# EAGLE schematic ESP-XBee (EAGLE 9.2.2)
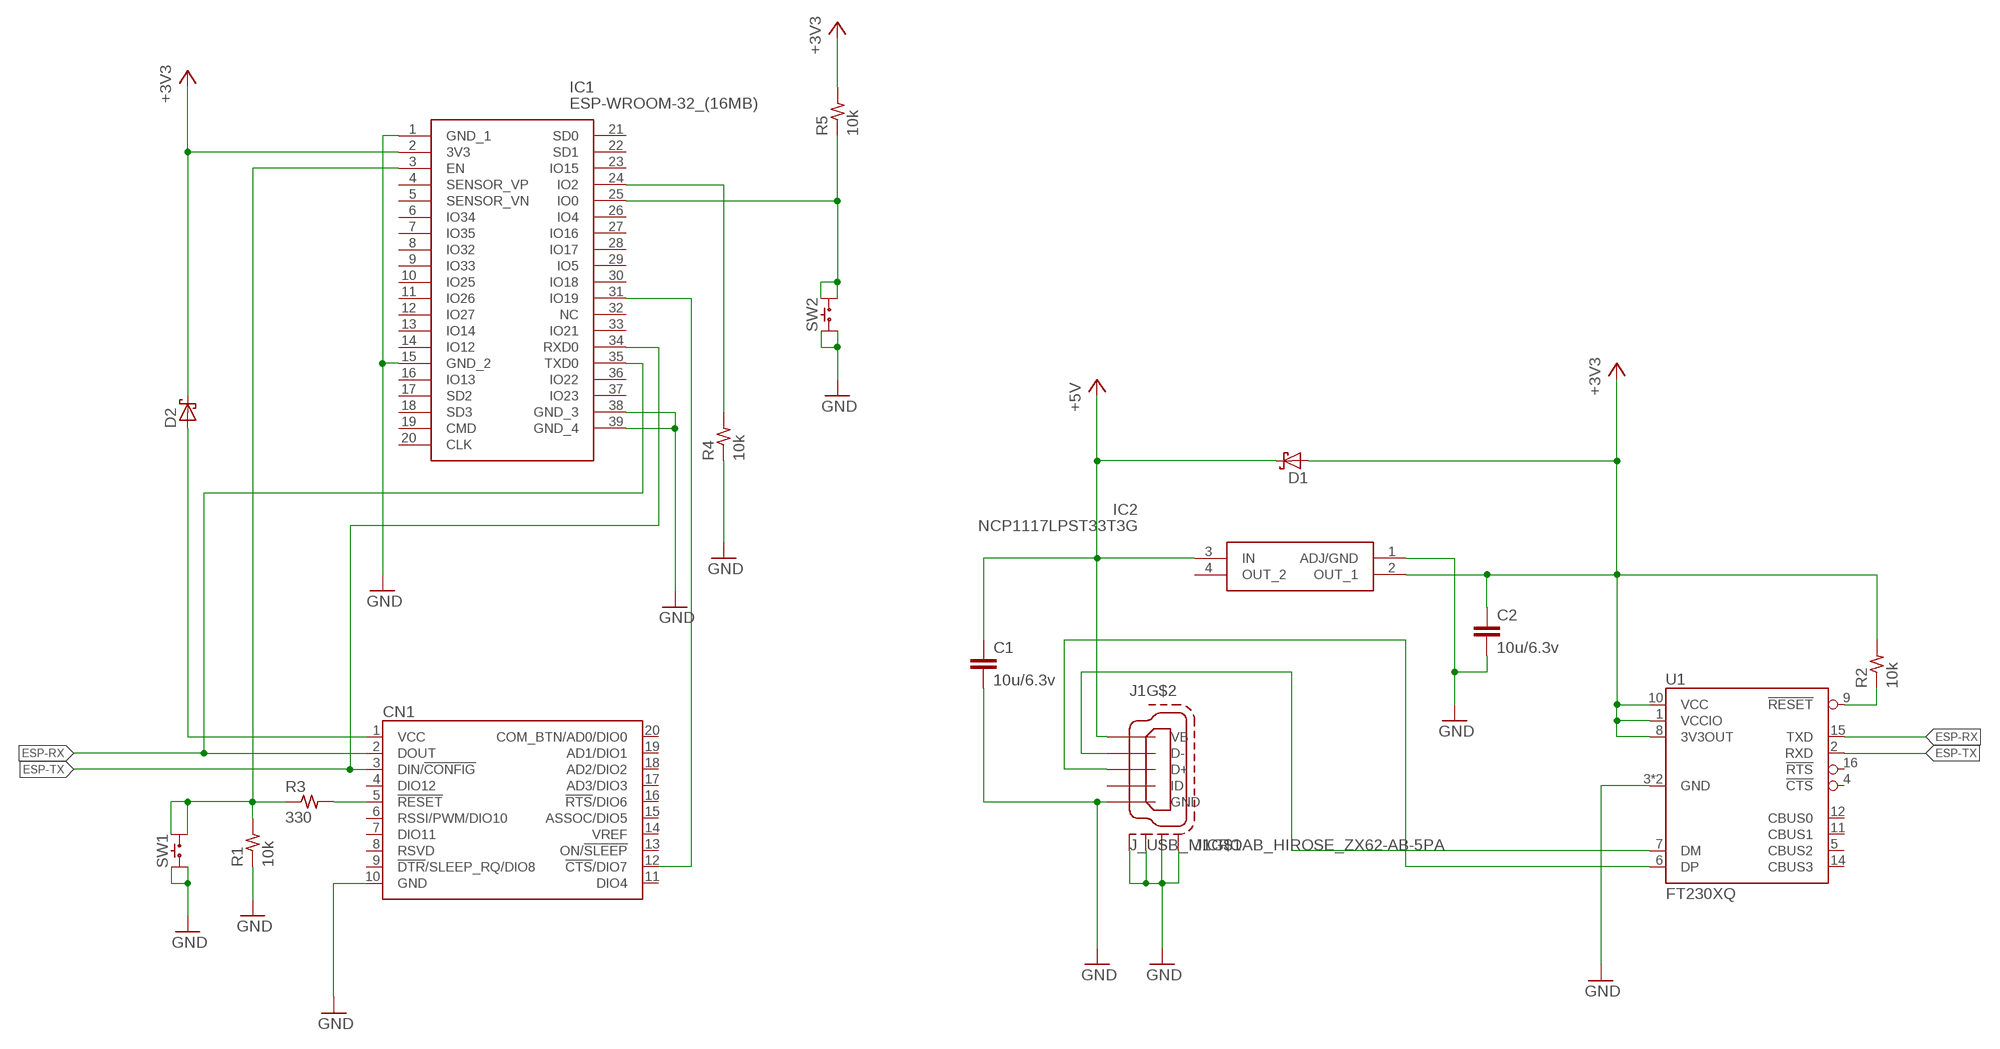
[diagram p0: schematic, sheet 1]

## Parts
C1  10u/6.3v  C1005  [1005]
C2  10u/6.3v  C1005  [1005]
CN1  XBEE-TH  [XBEE-TH]
D1  SBD-SOD523  [SOD523]
D2  SBD-SOD523  [SOD523]
IC1  ESP-WROOM-32_(16MB)  [ESP32SOLO1]
IC2  NCP1117LPST33T3G  [SOT230P700X180-4N]
J1  J_USB_MICROAB_HIROSE_ZX62-AB-5PA  [J_USB_MICROAB_HIROSE_ZX62-AB-5PA]
R1  10k  R1005  [1005]
R2  10k  R1005  [1005]
R3  330  R1005  [1005]
R4  10k  R1005  [1005]
R5  10k  R1005  [1005]
SW1  SKRP  [SKRP]
SW2  SKRP  [SKRP]
U1  FT230XQ  [QFN16-0.65-NOPAD]

## Nets
+3V3: C2.1 D1.A D2.K IC1.2(3V3) IC2.2(OUT_1) R2.2 R5.2 U1.1(VCCIO) U1.8(3V3OUT) U1.10(VCC)
+5V: C1.1 D1.K IC2.3(IN) J1.P$1(VB)
ESP-RX: CN1.2(DOUT) IC1.35(TXD0) U1.15(TXD)
ESP-TX: CN1.3(DIN/!CONFIG) IC1.34(RXD0) U1.2(RXD)
GND: C1.2 C2.2 CN1.10(GND) IC1.1(GND_1) IC1.15(GND_2) IC1.38(GND_3) IC1.39(GND_4) IC2.1(ADJ/GND) J1.P$5(GND) J1.SHIELD1(S1) J1.SHIELD2(S2) J1.SHIELD3(S3) J1.SHIELD4(S4) R1.1 R4.1 SW1.A1 SW1.A2 SW2.A1 SW2.A2 U1.3(GND) U1.13(GND)
N$1: CN1.1(VCC) D2.A
N$3: IC1.3(EN) R1.2 R3.1 SW1.B1 SW1.B2
N$5: J1.P$3(D+) U1.6(DP)
N$6: CN1.12(!CTS!/DIO7) IC1.31(IO19)
N$7: J1.P$2(D-) U1.7(DM)
N$9: R2.1 U1.9(!RESET)
N$12: CN1.5(!RESET) R3.2
N$13: IC1.24(IO2) R4.2
N$15: IC1.25(IO0) R5.1 SW2.B1 SW2.B2
Unconnected: CN1.4(DIO12) CN1.6(RSSI/PWM/DIO10) CN1.7(DIO11) CN1.8(RSVD) CN1.9(!DTR!/SLEEP_RQ/DIO8) CN1.11(DIO4) CN1.13(ON/!SLEEP) CN1.14(VREF) CN1.15(ASSOC/DIO5) CN1.16(!RTS!/DIO6) CN1.17(AD3/DIO3) CN1.18(AD2/DIO2) CN1.19(AD1/DIO1) CN1.20(COM_BTN/AD0/DIO0) IC1.4(SENSOR_VP) IC1.5(SENSOR_VN) IC1.6(IO34) IC1.7(IO35) IC1.8(IO32) IC1.9(IO33) IC1.10(IO25) IC1.11(IO26) IC1.12(IO27) IC1.13(IO14) IC1.14(IO12) IC1.16(IO13) IC1.17(SD2) IC1.18(SD3) IC1.19(CMD) IC1.20(CLK) IC1.21(SD0) IC1.22(SD1) IC1.23(IO15) IC1.26(IO4) IC1.27(IO16) IC1.28(IO17) IC1.29(IO5) IC1.30(IO18) IC1.32(NC) IC1.33(IO21) IC1.36(IO22) IC1.37(IO23) IC2.4(OUT_2) J1.P$4(ID) U1.4(!CTS) U1.5(CBUS2) U1.11(CBUS1) U1.12(CBUS0) U1.14(CBUS3) U1.16(!RTS)

## Library data of the parts
C1 C2 = Passive:C
CN1 = Module:XBEE-*
D1 D2 = Diode:SBD-*
IC1 = ESP-WROOM-32_(16MB):ESP-WROOM-32_(16MB): WiFi Modules (802.11) SMD Module, ESP32-D0WDQ6, 128Mbits SPI flash, UART Mode Source: Datasheet <https://www.espressif.com/sites/default/files/documentation/esp32-wroom-32_datasheet_en.pdf>; DESCRIPTION: WiFi Modules (802.11) SMD Module, ESP32-D0WDQ6, 128Mbits SPI flash, UART Mode; HEIGHT: mm; MANUFACTURER_NAME: Espressif Systems; MANUFACTURER_PART_NUMBER: ESP-WROOM-32 (16MB)
IC2 = NCP1117LPST33T3G:NCP1117LPST33T3G: Source: Datasheet <http://uk.rs-online.com/web/p/products/8022137P>; ALLIED_NUMBER: 70466897; HEIGHT: 1.8mm; MANUFACTURER_NAME: ON Semiconductor; MANUFACTURER_PART_NUMBER: NCP1117LPST33T3G; RS_PART_NUMBER: 8022137P; RS_PRICE-STOCK: http://uk.rs-online.com/web/p/products/8022137P
J1 = j_usb_hirose_zx62-ab-5pa:J_USB_MICROAB_HIROSE_ZX62-AB-5PA: USB Micro-AB SMT connector Hirose Electric Co Ltd: ZX62-AB-5P
R1-R5 = Passive:R
SW1 SW2 = Switch:SKRP
U1 = ic-FTDI:FT230X